# EAGLE design RAM_64K_512K (EAGLE 7.7.0)
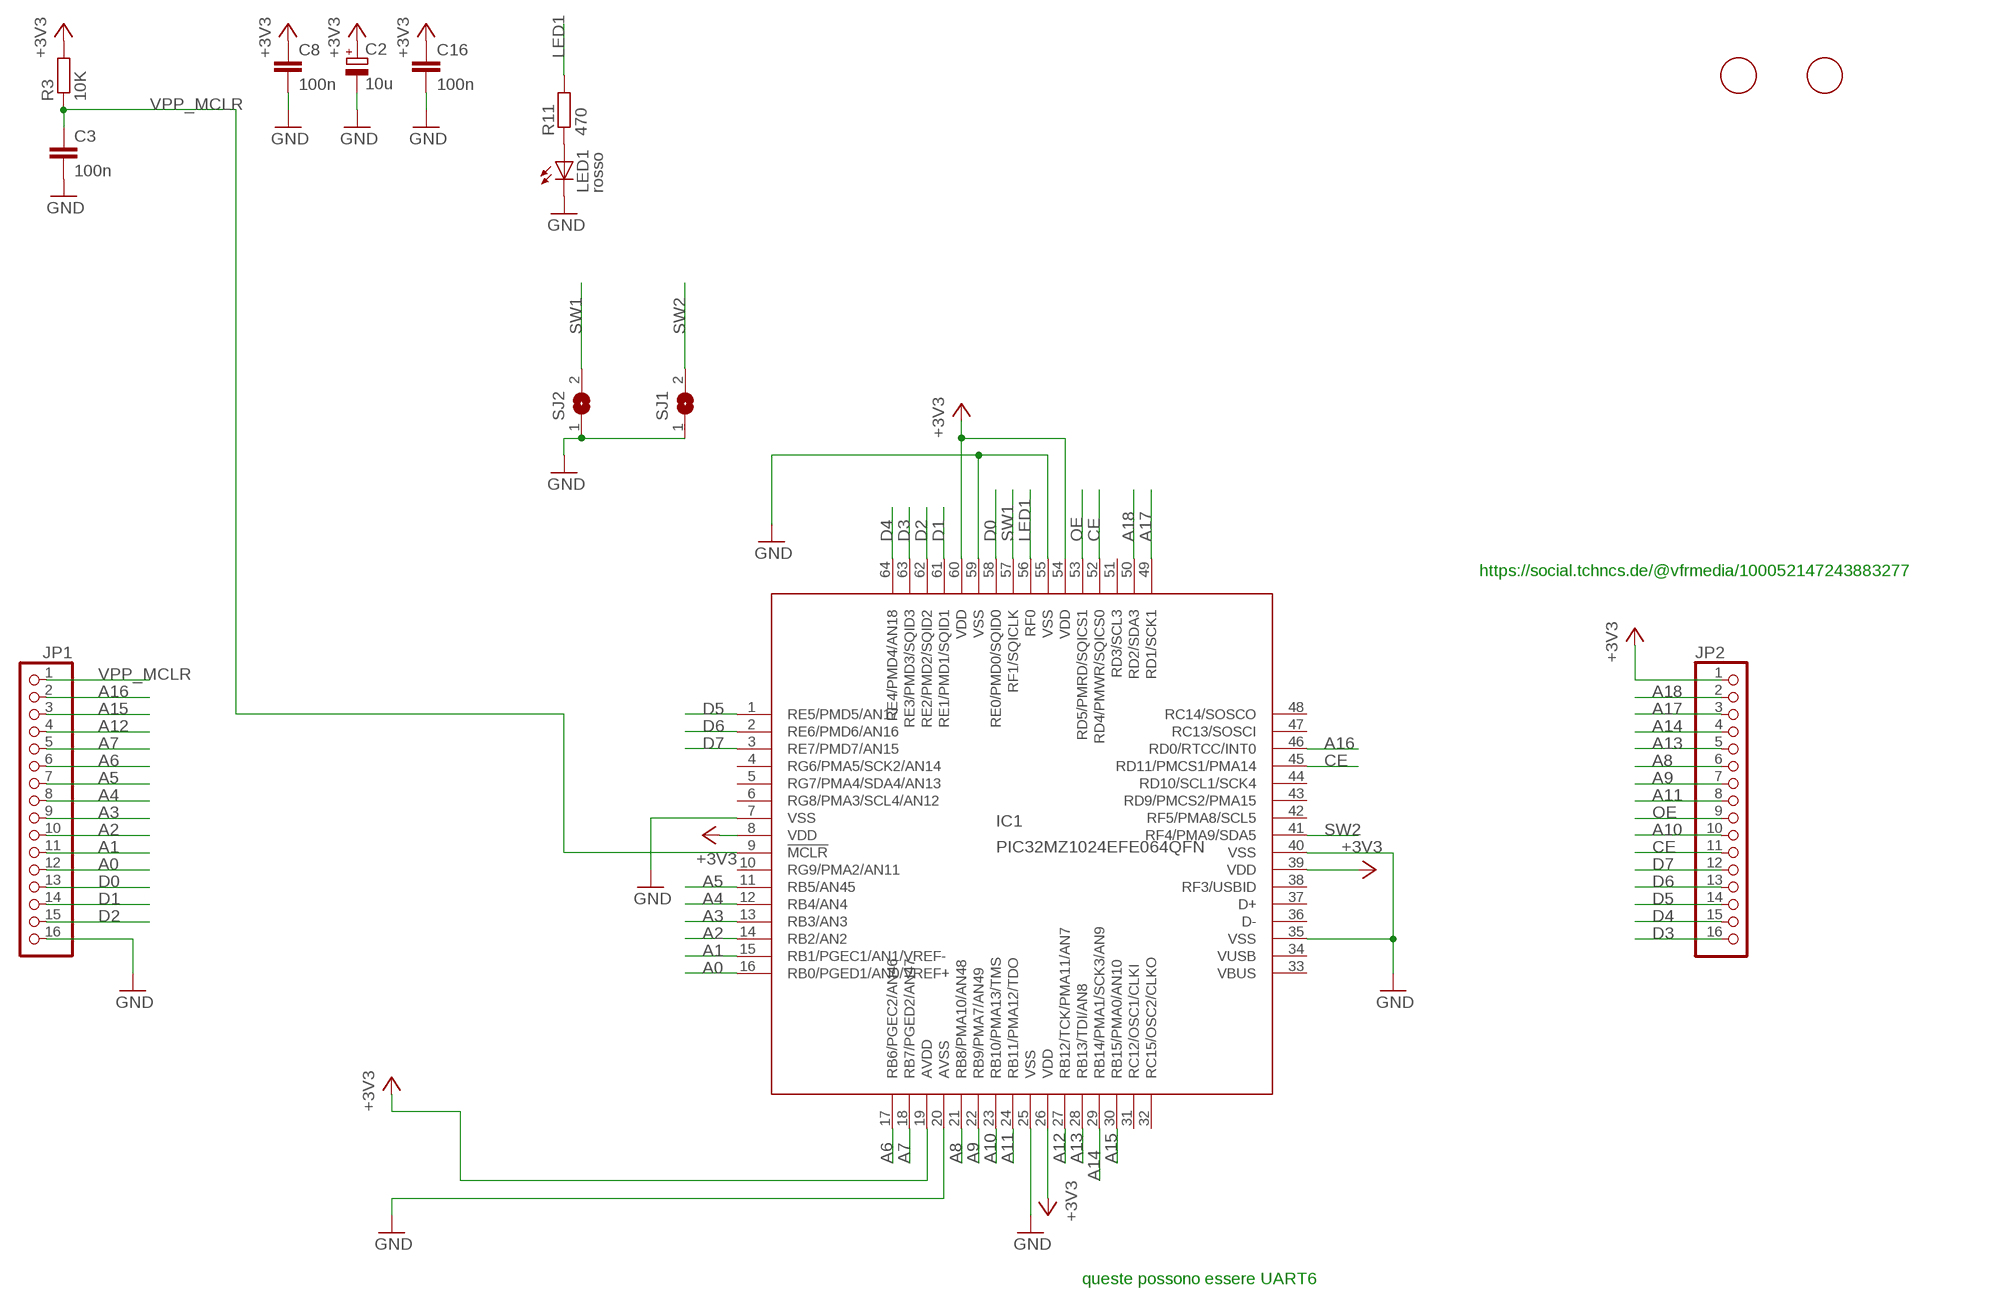
[diagram p0: schematic, sheet 1]

## Parts
C2  10u  CPOL-EUSMCB  [SMC_B]
C3  100n  C-EUC0805  [C0805]
C8  100n  C-EUC0805  [C0805]
C16  100n  C-EUC0805  [C0805]
F1  FIDUCIAL  [FIDUCIAL_1MM]
F2  FIDUCIAL  [FIDUCIAL_1MM]
IC1  PIC32MZ1024EFE064QFN  [QFN64]
JP1  PINHD-1X16_2.54  [1X16]
JP2  PINHD-1X16_2.54  [1X16]
LED1  rosso  LEDCHIPLED_0805  [CHIPLED_0805]
R3  10K  R-EU_R0805  [R0805]
R11  470  R-EU_R0805  [R0805]
SJ1  SJ  [SJ]
SJ2  SJ  [SJ]

## Nets
+3V3: C2.+ C8.1 C16.1 IC1.8(VDD) IC1.19(AVDD) IC1.26(VDD) IC1.39(VDD) IC1.54(VDD) IC1.60(VDD) JP2.1 R3.2
A0: IC1.16(RB0/PGED1/AN0/VREF+) JP1.12
A1: IC1.15(RB1/PGEC1/AN1/VREF-) JP1.11
A2: IC1.14(RB2/AN2) JP1.10
A3: IC1.13(RB3/AN3) JP1.9
A4: IC1.12(RB4/AN4) JP1.8
A5: IC1.11(RB5/AN45) JP1.7
A6: IC1.17(RB6/PGEC2/AN46) JP1.6
A7: IC1.18(RB7/PGED2/AN47) JP1.5
A8: IC1.21(RB8/PMA10/AN48) JP2.6
A9: IC1.22(RB9/PMA7/AN49) JP2.7
A10: IC1.23(RB10/PMA13/TMS) JP2.10
A11: IC1.24(RB11/PMA12/TDO) JP2.8
A12: IC1.27(RB12/TCK/PMA11/AN7) JP1.4
A13: IC1.28(RB13/TDI/AN8) JP2.5
A14: IC1.29(RB14/PMA1/SCK3/AN9) JP2.4
A15: IC1.30(RB15/PMA0/AN10) JP1.3
A16: IC1.46(RD0/RTCC/INT0) JP1.2
A17: IC1.49(RD1/SCK1) JP2.3
A18: IC1.50(RD2/SDA3) JP2.2
CE: IC1.45(RD11/PMCS1/PMA14) IC1.52(RD4/PMWR/SQICS0) JP2.11
D0: IC1.58(RE0/PMD0/SQID0) JP1.13
D1: IC1.61(RE1/PMD1/SQID1) JP1.14
D2: IC1.62(RE2/PMD2/SQID2) JP1.15
D3: IC1.63(RE3/PMD3/SQID3) JP2.16
D4: IC1.64(RE4/PMD4/AN18) JP2.15
D5: IC1.1(RE5/PMD5/AN17) JP2.14
D6: IC1.2(RE6/PMD6/AN16) JP2.13
D7: IC1.3(RE7/PMD7/AN15) JP2.12
GND: C2.- C3.2 C8.2 C16.2 IC1.7(VSS) IC1.20(AVSS) IC1.25(VSS) IC1.35(VSS) IC1.40(VSS) IC1.55(VSS) IC1.59(VSS) JP1.16 LED1.C SJ1.1 SJ2.1
LED1: IC1.56(RF0) R11.2
N$7: LED1.A R11.1
OE: IC1.53(RD5/PMRD/SQICS1) JP2.9
SW1: IC1.57(RF1/SQICLK) SJ2.2
SW2: IC1.41(RF4/PMA9/SDA5) SJ1.2
VPP_MCLR: C3.1 IC1.9(!MCLR) JP1.1 R3.1
Unconnected: IC1.4(RG6/PMA5/SCK2/AN14) IC1.5(RG7/PMA4/SDA4/AN13) IC1.6(RG8/PMA3/SCL4/AN12) IC1.10(RG9/PMA2/AN11) IC1.31(RC12/OSC1/CLKI) IC1.32(RC15/OSC2/CLKO) IC1.33(VBUS) IC1.36(D-) IC1.37(D+) IC1.38(RF3/USBID) IC1.42(RF5/PMA8/SCL5) IC1.43(RD9/PMCS2/PMA15) IC1.44(RD10/SCL1/SCK4) IC1.47(RC13/SOSCI) IC1.48(RC14/SOSCO) IC1.51(RD3/SCL3)

## Notes on the sheet
- https://social.tchncs.de/@vfrmedia/100052147243883277
- queste possono essere UART6

## Power pins joined to a net without a drawn wire
VUSB: IC1.34(VUSB)

## Library data of the parts
C2 = resistor:CPOL-EU: POLARIZED CAPACITOR, European symbol
C3 C8 C16 = resistor:C-EU: CAPACITOR, European symbol
F1 F2 = adafruit:FIDUCIAL: For use by pick and place machines to calibrate the vision/machine, 1mm By microbuilder.eu
IC1 = microchip2:PIC32MZ1024EFE064: PIC32MX340FxxxH Source: http://ww1.microchip.com/downloads/en/DeviceDoc/61143E.pdf, PIC32MZ1024EFE064.bsdl
JP1 JP2 = pinhead-2:PINHD-1X16: PIN HEADER
LED1 = led:LED: LED OSRAM: - CHIPLED LG R971, LG N971, LY N971, LG Q971, LY Q971, LO R971, LY R971 LH N974, LH R974 LS Q976, LO Q976, LY Q976 LO Q996 - Hyper CHIPLED LW Q18S LB Q993, LB Q99A, LB R99A - SideLED LS A670, LO A670, LY A670, LG A670, LP A670 LB A673, LV A673, LT A673, LW A673 LH A674 LY A675 LS A676, LA A676, LO A676, LY A676, LW A676 LS A679, LY A679, LG A679 - Hyper Micro SIDELED® LS Y876, LA Y876, LO Y876, LY Y876 LT Y87S - SmartLED LW L88C, LW L88S LB L89C, LB L89S, LG L890 LS L89K, LO L89K, LY L89K LS L896, LA L896, LO L896, LY L896 - TOPLED LS T670, LO T670, LY T670, LG T670, LP T670 LSG T670, LSP T670, LSY T670, LOP T670, LYG T670 LG T671, LOG T671, LSG T671 LB T673, LV T673, LT T673, LW T673 LH T674 LS T676, LA T676, LO T676, LY T676, LB T676, LH T676, LSB T676, LW T676 LB T67C, LV T67C, LT T67C, LS T67K, LO T67K, LY T67K, LW E67C LS E67B, LA E67B, LO E67B, LY E67B, LB E67C, LV E67C, LT E67C LW T67C LS T679, LY T679, LG T679 LS T770, LO T770, LY T770, LG T770, LP T770 LB T773, LV T773, LT T773, LW T773 LH T774 LS E675, LA E675, LY E675, LS T675 LS T776, LA T776, LO T776, LY T776, LB T776 LHGB T686 LT T68C, LB T68C - Hyper Mini TOPLED® LB M676 - Mini TOPLED Santana® LG M470 LS M47K, LO M47K, LY M47K Source: http://www.osram.convergy.de LUXEON: - LUMILED® LXK2-PW12-R00, LXK2-PW12-S00, LXK2-PW14-U00, LXK2-PW14-V00 LXK2-PM12-R00, LXK2-PM12-S00, LXK2-PM14-U00 LXK2-PE12-Q00, LXK2-PE12-R00, LXK2-PE12-S00, LXK2-PE14-T00, LXK2-PE14-U00 LXK2-PB12-K00, LXK2-PB12-L00, LXK2-PB12-M00, LXK2-PB14-N00, LXK2-PB14-P00, LXK2-PB14-Q00 LXK2-PR12-L00, LXK2-PR12-M00, LXK2-PR14-Q00, LXK2-PR14-R00 LXK2-PD12-Q00, LXK2-PD12-R00, LXK2-PD12-S00 LXK2-PH12-R00, LXK2-PH12-S00 LXK2-PL12-P00, LXK2-PL12-Q00, LXK2-PL12-R00 Source: www.luxeon.com KINGBRIGHT: KA-3528ASYC Source: www.kingbright.com
R3 R11 = resistor:R-EU_: RESISTOR, European symbol
SJ1 SJ2 = jumper:SJ: SMD solder JUMPER

## Net classes
2 N2: width 0.762 mm, clearance 0.762 mm
3 N3: width 0.508 mm
4 N4: width 0.305 mm

## Board
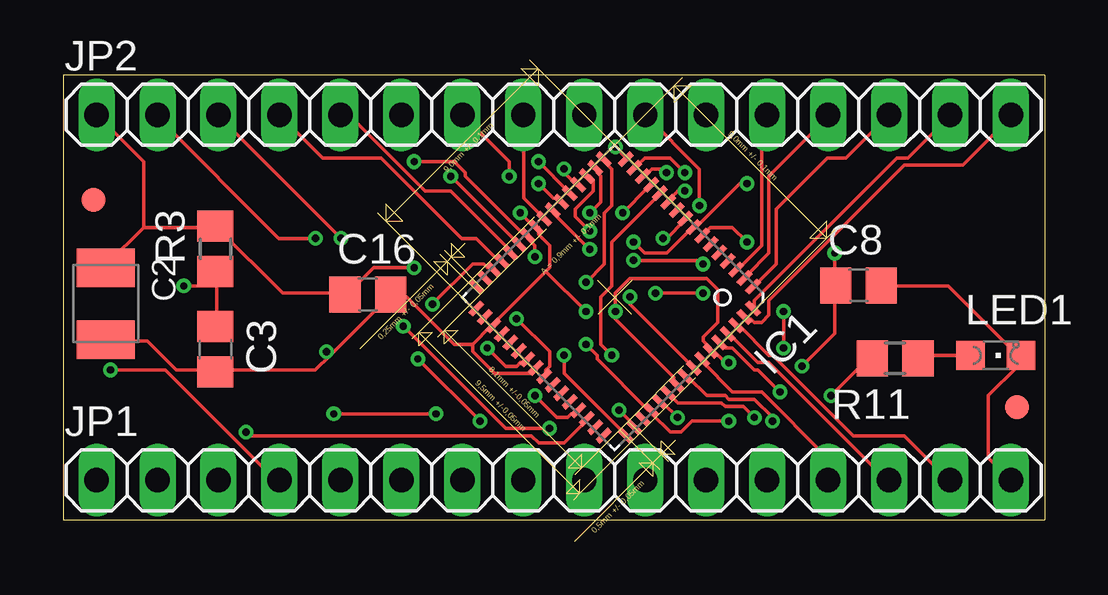
[diagram p1: board, top side]
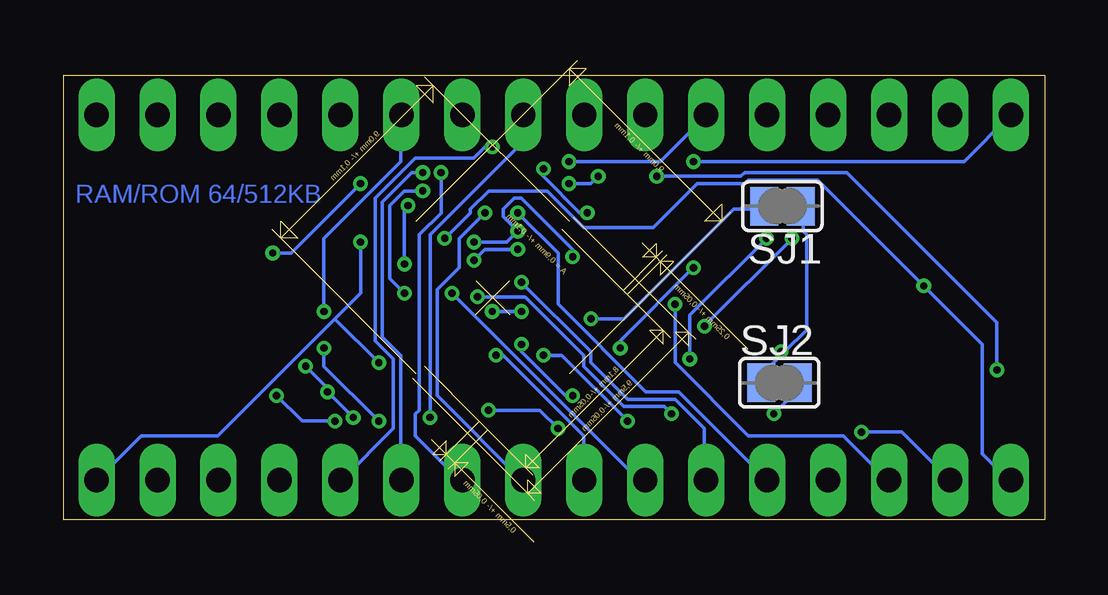
[diagram p2: board, bottom side, seen from below]

Size 40.89 x 18.53 mm. Coordinates in mm from the lower left corner, seen from the top.
Outline: 0,0 40.89,0 40.89,18.53 0,18.53 0,0
Copper layers (1*16): Top 0.035mm / dielectric 1.5mm / Bottom 0.035mm
Design rules "SeeedStudio_2layer_DRU_no_angle_20140221": minimum track width 6mil, minimum drill 12mil, track to track 6mil, track to pad 6mil, pad to pad 6mil, via to via 6mil, smd to smd 0mil, copper to edge 10mil, drill to drill 10mil, minimum pad ring 10mil, minimum via ring 6mil, stop-mask expansion 2mil, vias tented up to drill 100mil, thermal gap 10mil

### Footprints (pad centres in the part's own frame; a part is rotated, then mirrored left to right if it is on the bottom)
SMC_B = smd 1.6 x 2.4: + -1.5,0; - 1.5,0
C0805 = smd 1.3 x 1.5: 1 -0.95,0; 2 0.95,0
FIDUCIAL_1MM = smd 1 x 1: 1 0,0
QFN64 = smd 0.7 x 0.25: 1 -4.4,3.75; 2 -4.4,3.25; 3 -4.4,2.75; 4 -4.4,2.25; 5 -4.4,1.75; 6 -4.4,1.25; 7 -4.4,0.75; 8 -4.4,0.25; 9 -4.4,-0.25; 10 -4.4,-0.75; 11 -4.4,-1.25; 12 -4.4,-1.75; 13 -4.4,-2.25; 14 -4.4,-2.75; 15 -4.4,-3.25; 16 -4.4,-3.75; 33 4.4,-3.75; 34 4.4,-3.25; 35 4.4,-2.75; 36 4.4,-2.25; 37 4.4,-1.75; 38 4.4,-1.25; 39 4.4,-0.75; 40 4.4,-0.25; 41 4.4,0.25; 42 4.4,0.75; 43 4.4,1.25; 44 4.4,1.75; 45 4.4,2.25; 46 4.4,2.75; 47 4.4,3.25; 48 4.4,3.75 | smd 0.25 x 0.7: 17 -3.75,-4.4; 18 -3.25,-4.4; 19 -2.75,-4.4; 20 -2.25,-4.4; 21 -1.75,-4.4; 22 -1.25,-4.4; 23 -0.75,-4.4; 24 -0.25,-4.4; 25 0.25,-4.4; 26 0.75,-4.4; 27 1.25,-4.4; 28 1.75,-4.4; 29 2.25,-4.4; 30 2.75,-4.4; 31 3.25,-4.4; 32 3.75,-4.4; 49 3.75,4.4; 50 3.25,4.4; 51 2.75,4.4; 52 2.25,4.4; 53 1.75,4.4; 54 1.25,4.4; 55 0.75,4.4; 56 0.25,4.4; 57 -0.25,4.4; 58 -0.75,4.4; 59 -1.25,4.4; 60 -1.75,4.4; 61 -2.25,4.4; 62 -2.75,4.4; 63 -3.25,4.4; 64 -3.75,4.4
1X16 = drill 1.016 long: 1 -19.05,0; 2 -16.51,0; 3 -13.97,0; 4 -11.43,0; 5 -8.89,0; 6 -6.35,0; 7 -3.81,0; 8 -1.27,0; 9 1.27,0; 10 3.81,0; 11 6.35,0; 12 8.89,0; 13 11.43,0; 14 13.97,0; 15 16.51,0; 16 19.05,0
CHIPLED_0805 = smd 1.2 x 1.2: A 0,-1.05; C 0,1.05
R0805 = smd 1.3 x 1.5: 1 -0.95,0; 2 0.95,0
SJ = smd 1.168 x 1.6: 1 -0.762,0; 2 0.762,0

### Placement (x,y rotation side)
C2  1.78,9.02 270 top
C3  6.35,7.11 270 top
C8  33.15,9.78 0 top
C16  12.7,9.4 0 top
F1  1.27,13.34 0 top
F2  39.75,4.7 0 top
IC1  22.99,9.27 225 top
JP1  20.45,1.65 0 top
JP2  20.45,16.89 0 top
LED1  38.86,6.86 270 top
R3  6.35,11.3 90 top
R11  34.67,6.73 180 top
SJ1  10.92,13.08 180 bottom
SJ2  11.05,5.71 0 bottom

### Tracks (layer width: path | path; a pad name or v marks a point on that pad's centre or on a via)
+3V3  (via drill 0.3)
  Top 0.152: v28.8,4.27 28.35,4.72 27.58,4.72 27.43,4.88 25.6,4.88 25.3,5.18 IC1.54 | v29.87,5.33 28.96,6.25 28.8,6.25 27.89,7.16 27.58,7.16 27.43,7.32 IC1.60 | v30.79,6.4 32.16,7.77 32.16,9.75 C8.1 32.16,9.91 v32.16,11.12 | v17.68,7.16 18.44,6.4 18.9,6.4 19.05,6.55 19.2,6.55 IC1.39 | v14.63,10.52 12.95,10.52 11.89,9.45 C16.1 11.73,9.45 9.14,9.45 6.4,12.19 R3.2 6.25,12.19 3.35,12.19 | 3.35,12.19 1.83,10.67 C2.+ | v23.77,11.58 24.23,11.12 25.15,11.12 26.21,12.19 IC1.8 26.36,12.19 28.19,14.02 v28.5,14.02 | v21.95,12.04 21.34,12.65 21.34,12.95 22.1,13.72 22.1,14.17 21.95,14.33 IC1.19 | v14.63,14.94 16.31,14.94 16.76,14.48 16.76,14.33 19.2,11.89 IC1.26 19.36,11.73 19.66,11.43 v19.66,10.97 | 3.35,12.19 3.35,14.94 JP2.1
  Bottom 0.152: v28.8,4.27 v29.87,5.33 29.87,5.49 v30.79,6.4 | v17.68,7.16 17.68,7.47 v14.63,10.52 | v23.77,11.58 22.4,11.58 v21.95,12.04 22.55,12.65 22.55,12.95 22.1,13.41 21.79,13.41 19.66,11.28 v19.66,10.97 | v14.63,14.94 3.35,14.94 JP2.1 | v32.16,11.12 31.39,11.12 v28.5,14.02
A0  (via drill 0.3)
  Top 0.152: v23.01,15.54 23.47,15.09 IC1.16
  Bottom 0.152: v23.01,15.54 23.32,15.54 23.77,15.09 26.21,15.09 27.89,13.41 27.89,7.47 27.13,6.71 27.13,3.81 29.26,1.68 JP1.12
A1  (via drill 0.3)
  Top 0.152: v25.91,14.48 25.3,15.09 24.23,15.09 23.93,14.78 IC1.15
  Bottom 0.152: v25.91,14.48 26.36,14.48 27.58,13.26 27.58,7.62 26.82,6.86 26.82,1.68 JP1.11
A2  (via drill 0.3)
  Top 0.152: v25.15,14.48 24.99,14.63 24.54,14.63 24.38,14.48 24.23,14.48 IC1.14
  Bottom 0.152: v25.15,14.48 25.15,12.8 26.06,11.89 26.06,4.57 26.21,4.42 26.21,3.5 24.38,1.68 JP1.10
A3  (via drill 0.3)
  Top 0.152: v23.32,12.8 24.38,13.87 IC1.13
  Bottom 0.152: v23.32,12.8 24.38,11.73 24.38,10.52 25.3,9.6 25.3,5.18 21.79,1.68 JP1.9
A4  (via drill 0.3)
  Top 0.152: v22.86,6.86 22.4,7.32 22.4,9.3 22.86,9.75 22.86,11.58 24.84,13.56 IC1.12
  Bottom 0.152: v22.86,6.86 22.55,6.86 19.2,3.5 19.2,1.68 JP1.8
A5  (via drill 0.3)
  Top 0.152: v25.91,13.72 25.6,13.72 25.3,13.41 IC1.11 | v24.69,9.45 v26.67,9.45
  Bottom 0.152: v25.91,13.72 26.67,13.72 27.28,13.11 27.28,10.06 v26.67,9.45 | v24.69,9.45 16.76,1.52 JP1.7
A6  (via drill 0.3)
  Top 0.152: v21.79,9.91 22.55,10.67 22.55,12.8 22.86,13.11 22.86,14.63 22.55,14.94 IC1.17
  Bottom 0.152: v21.79,9.91 18.9,7.01 18.9,6.55 17.37,5.03 15.39,5.03 14.17,3.81 14.17,1.68 JP1.6
A7  (via drill 0.3)
  Top 0.152: v21.95,12.8 22.4,13.26 22.4,14.33 22.25,14.48 22.25,14.63 IC1.18
  Bottom 0.152: v21.95,12.8 20.27,11.12 20.27,8.99 16.61,5.33 15.24,5.33 JP1.5
A8  (via drill 0.3)
  Top 0.152: v19.81,14.94 21.03,13.72 IC1.21
  Bottom 0.152: v19.81,14.94 16,14.94 14.17,16.76 JP2.6
A9  (via drill 0.3)
  Top 0.152: v19.81,14.02 20.42,13.41 20.73,13.41 IC1.22 | v18.59,14.33 18.59,14.94 JP2.7
  Bottom 0.152: v19.81,14.02 18.9,14.02 v18.59,14.33
A10  (via drill 0.3)
  Top 0.152: v21.95,11.28 20.42,12.8 IC1.23 | v23.77,10.82 26.52,10.82 v26.67,10.67 | v26.52,13.11 26.52,14.63 JP2.10
  Bottom 0.152: v21.95,11.28 23.32,11.28 v23.77,10.82 | v26.67,10.67 26.67,12.95 v26.52,13.11
A11
  Top 0.152: IC1.24 19.96,12.65 19.2,13.41 19.2,16.76 JP2.8
A12  (via drill 0.3)
  Top 0.152: v16.15,14.33 18.9,11.58 IC1.27 | v1.98,6.25 4.27,6.25 8.99,1.52 JP1.4
  Bottom 0.152: v16.15,14.33 12.65,14.33 12.5,14.48 8.23,14.48 1.98,8.23 v1.98,6.25
A13
  Top 0.152: IC1.28 18.59,11.28 16.15,13.72 15.09,13.72 12.04,16.76 11.58,16.76 JP2.5
A14
  Top 0.152: JP2.4 10.82,15.09 13.26,15.09 16.61,11.73 17.22,11.73 18.14,10.82 IC1.29
A15  (via drill 0.3)
  Top 0.152: v15.39,8.99 17.07,10.67 17.53,10.67 17.68,10.52 17.83,10.52 IC1.30
  Bottom 0.152: v15.39,8.99 15.39,6.55 12.34,3.5 8.38,3.5 6.55,1.68 JP1.3
A16  (via drill 0.3)
  Top 0.152: v7.62,3.66 7.77,3.5 19.51,3.5 19.81,3.2 20.88,3.2 21.79,4.12 IC1.46
  Bottom 0.152: v7.62,3.66 5.94,3.66 JP1.2
A17  (via drill 0.3)
  Top 0.152: v20.88,6.86 20.88,6.1 23.32,3.66 IC1.49 | v14.78,6.71 v17.37,4.12 | v11.58,11.73 6.55,16.76 JP2.3
  Bottom 0.152: v20.88,6.86 20.12,6.86 v17.37,4.12 | v14.78,6.71 14.78,8.53 v11.58,11.73
A18  (via drill 0.3)
  Top 0.152: v23.16,4.57 23.77,3.96 IC1.50 | v20.27,3.81 18.44,3.81 v14.17,8.08 | v10.52,11.73 8.99,11.73 3.96,16.76 JP2.2
  Bottom 0.152: v23.16,4.57 21.03,4.57 v20.27,3.81 | v10.52,11.73 v14.17,8.08
CE  (via drill 0.3)
  Top 0.152: v19.66,5.18 20.57,4.27 21.03,4.27 21.18,4.42 21.34,4.42 IC1.45 | v21.79,7.32 22.25,6.86 22.25,6.71 24.38,4.57 IC1.52 24.54,4.42 25.3,3.66 25.76,3.66 26.21,4.12 v27.74,4.12 | v30.02,7.16 v30.02,8.69
  Bottom 0.152: v19.66,5.18 19.96,5.18 21.79,7.01 v21.79,7.32 | v30.02,8.69 30.02,11.73 26.82,14.94 26.82,16.76 JP2.11 | v30.02,7.16 30.02,6.4 v27.74,4.12
D0
  Top 0.152: IC1.58 26.67,6.55 27.89,5.33 29.11,5.33 31.85,2.59 31.85,1.68 JP1.13
D1
  Top 0.152: IC1.61 27.74,7.62 27.89,7.62 28.96,6.55 29.41,6.55 34.29,1.68 JP1.14
D2
  Top 0.152: IC1.62 28.19,8.08 29.41,6.86 29.57,6.86 32.92,3.5 35.05,3.5 36.88,1.68 JP1.15
D3
  Top 0.152: IC1.63 28.5,8.38 28.65,8.38 28.8,8.23 29.11,8.23 29.41,8.53 29.41,9.14 35.05,14.78 37.49,14.78 39.47,16.76 JP2.16
D4
  Top 0.152: IC1.64 28.8,8.84 28.8,9.14 34.75,15.09 35.2,15.09 36.88,16.76 JP2.15
D5
  Top 0.152: JP2.14 32.61,15.09 31.85,15.09 29.72,12.95 29.72,10.67 28.8,9.75 IC1.1
D6
  Top 0.152: IC1.2 28.5,10.21 29.41,11.12 29.41,14.33 31.85,16.76 JP2.13
D7
  Top 0.152: IC1.3 28.19,10.52 29.11,11.43 29.11,16.61 29.26,16.76 JP2.12
GND  (via drill 0.3)
  Top 0.152: IC1.55 25.45,5.64 25.45,5.94 23.01,8.38 v23.01,8.69 23.01,9.45 23.62,10.06 26.82,10.06 27.28,9.6 27.28,8.23 26.67,7.62 26.67,7.47 26.98,7.16 IC1.59 27.13,7.01 27.58,6.55 v27.74,6.55 | v28.5,11.58 27.89,12.19 26.98,12.19 26.67,11.89 IC1.7 | 39.78,6.86 39.78,6.4 38.56,5.18 38.56,2.59 JP1.16 | 39.78,6.86 36.88,9.75 34.14,9.75 C8.2 | 39.78,6.86 LED1.C | C2.- 1.83,7.47 3.5,7.47 4.72,6.25 6.25,6.25 C3.2 6.4,6.25 10.52,6.25 11.12,6.86 | 17.07,7.32 17.83,8.08 IC1.35 17.98,8.23 20.12,10.36 | 17.07,7.32 17.07,7.01 17.98,6.1 19.51,6.1 19.66,6.25 IC1.40 | 20.12,10.36 20.27,10.52 20.27,11.43 19.81,11.89 19.81,12.19 IC1.25 19.66,12.19 v19.05,12.8 | v20.88,14.63 20.88,14.48 21.34,14.02 IC1.20 | 17.07,7.32 16.31,7.32 14.33,9.3 13.72,9.3 C16.2 13.56,9.3 11.12,6.86 | 11.12,6.86 v10.97,7.01 | 20.12,10.36 v21.79,8.69
  Bottom 0.152: v28.5,11.58 28.5,9.45 29.57,8.38 | 29.57,8.38 34.44,3.5 37.64,3.5 JP1.16 | 29.57,8.38 v27.74,6.55 | 10.82,7.01 11.73,6.1 11.73,5.79 SJ2.1 | 10.82,7.01 9.91,7.92 9.91,11.89 10.06,12.04 10.06,12.95 SJ1.1 | v20.88,14.63 20.88,14.33 19.36,12.8 v19.05,12.8 | v10.97,7.01 10.82,7.01 | v21.79,8.69 v23.01,8.69
LED1  (via drill 0.3)
  Top 0.152: v29.57,4.12 29.57,4.27 28.8,5.03 27.74,5.03 27.58,5.18 26.82,5.18 26.06,5.94 IC1.56 | v32,5.18 33.68,6.86 R11.2
  Bottom 0.152: v29.57,4.12 30.94,4.12 v32,5.18
N$7
  Top 0.152: LED1.A 35.66,6.86 R11.1
OE  (via drill 0.3)
  Top 0.152: v25.6,4.27 24.99,4.88 IC1.53
  Bottom 0.152: v25.6,4.27 25.6,11.89 21.79,15.7 21.79,16.76 JP2.9
SW1  (via drill 0.3)
  Top 0.152: v23.62,9.3 23.62,8.99 26.21,6.4 IC1.57 | v11.28,4.42 v15.54,4.42
  Bottom 0.152: v23.62,9.3 21.64,9.3 19.2,6.86 19.2,6.4 17.53,4.72 15.85,4.72 v15.54,4.42 | v11.28,4.42 10.36,5.33 10.36,5.64 SJ2.2
SW2  (via drill 0.3)
  Top 0.152: v18.9,8.38 20.27,7.01 20.27,6.4 20.12,6.25 20.12,6.1 IC1.41
  Bottom 0.152: v18.9,8.38 17.53,8.38 12.95,12.95 11.73,12.95 SJ1.2
VPP_MCLR  (via drill 0.3)
  Top 0.152: 6.4,9.75 6.4,10.21 R3.1 6.4,9.75 | 6.4,9.75 6.4,8.08 C3.1 | v24.99,11.73 25.15,11.73 25.91,12.5 IC1.9 | v5.03,9.75 6.4,9.75
  Bottom 0.152: v24.99,11.73 23.93,12.8 23.93,12.95 23.16,13.72 20.73,13.72 19.2,12.19 16.31,12.19 14.48,14.02 12.5,14.02 12.34,14.17 9.45,14.17 v5.03,9.75 2.59,7.32 2.59,2.74 1.52,1.68 JP1.1

### Text on the board
Bottom: RAM/ROM 64/512KB